# Altium schematic sheet Thermistors.SchDoc: Thermistors
size Letter; DocumentNumber: 7; SheetNumber: 7; SheetTotal: 11
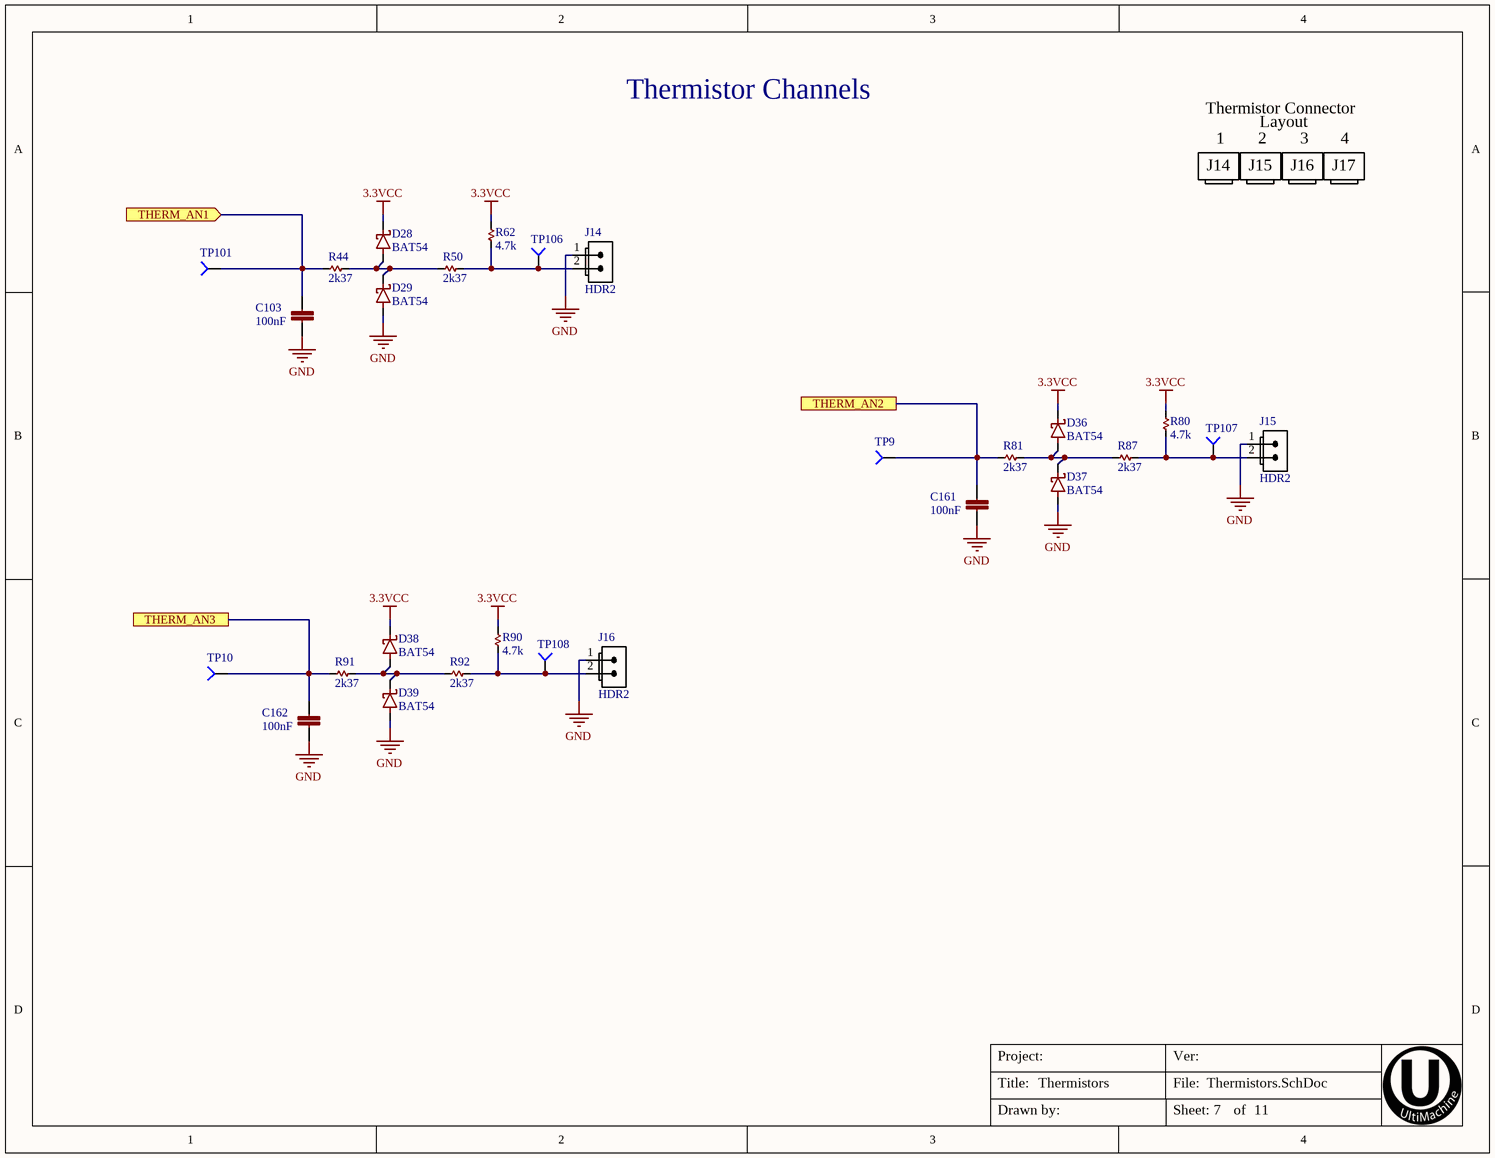
[diagram p0: Thermistors.SchDoc]

## Parts
C103  100nF  [C0402]
C161  100nF  [C0402]
C162  100nF  [C0402]
D28  BAT54  [SOD523_IPC]
D29  BAT54  [SOD523_IPC]
D36  BAT54  [SOD523_IPC]
D37  BAT54  [SOD523_IPC]
D38  BAT54  [SOD523_IPC]
D39  BAT54  [SOD523_IPC]
J14  value HDR2  [70543-01 PIN-IN-PASTE]  (hidden comment: CONN 2PIN VERT 0.1" SHRD LOCKING PIP)
J15  value HDR2  [70543-01 PIN-IN-PASTE]  (hidden comment: CONN 2PIN VERT 0.1" SHRD LOCKING PIP)
J16  value HDR2  [70543-01 PIN-IN-PASTE]  (hidden comment: CONN 2PIN VERT 0.1" SHRD LOCKING PIP)
R44  2k37  [R0402]
R50  2k37  [R0402]
R62  4.7k  [R0402]
R80  4.7k  [R0402]
R81  2k37  [R0402]
R87  2k37  [R0402]
R90  4.7k  [R0402]
R91  2k37  [R0402]
R92  2k37  [R0402]
TP9  TP4  [TP-2]  (value not drawn)  (no BOM)
TP10  TP4  [TP-2]  (value not drawn)  (no BOM)
TP101  TP4  [TP-2]  (value not drawn)  (no BOM)
TP106  TP4  [TP-2]  (value not drawn)  (no BOM)
TP107  TP4  [TP-2]  (value not drawn)  (no BOM)
TP108  TP4  [TP-2]  (value not drawn)  (no BOM)

## Ports
THERM_AN1 (in), THERM_AN2, THERM_AN3

## Nets
3.3VCC: D28.K D36.K D38.K R62.2 R80.2 R90.2
GND: C103.2 C161.2 C162.2 D29.A D37.A D39.A J14.1(S) J15.1(S) J16.1(S)
THERM_AN1: C103.1 R44.1 TP101.1 ; port THERM_AN1
THERM_AN2: C161.1 R81.1 TP9.1 ; port THERM_AN2
THERM_AN3: C162.1 R91.1 TP10.1 ; port THERM_AN3
NetD28_A: D28.A D29.K R44.2 R50.1
NetD36_A: D36.A D37.K R81.2 R87.1
NetD38_A: D38.A D39.K R91.2 R92.1
NetJ14_2: J14.2(S) R50.2 R62.1 TP106.1
NetJ15_2: J15.2(S) R80.1 R87.2 TP107.1
NetJ16_2: J16.2(S) R90.1 R92.2 TP108.1

## Notes on the sheet
- Thermistor Channels
- Thermistor Connector
- 1
- 2
- Layout
- 3
- 4
- J14
- J15
- J16
- J17
- Title:
- Project:
- File:
- Ver:
- Drawn by:
- Sheet:
- of

## Library data of the parts
C103 C161 C162 = GRM155R71C104KA88D: CAP CER 0402 100nF 16V 10% X7R; MANUFACTURER: Murata; PART DESCRIPTION: 0.10µF ±10% 16V Ceramic Capacitor X7R 0402 (1005 Metric); EE_SPEC: 100nF 16V X7R 0402; VALUE: 100nF; MANUFACTURER #: GRM155R71C104KA88D; DISTRIBUTOR #: 490-3261-2-ND; DISTRIBUTOR: Digi-Key Electronics; PART: GRM155R71C104KA88D; TOLERANCE: 10%
D28 D29 D36-D39 = BAT54WX: DIODE SCHOTTKY 30V 200MA SOD523; MANUFACTURER: Diodes Incorporated; MANUFACTURER #: BAT54WX-TP; PART DESCRIPTION: Diode Schottky 30V 200mA (DC) Surface Mount SOD-523; TOLERANCE: -NA-; VALUE: BAT54; DISTRIBUTOR #: BAT54WX-TPTR-ND; DISTRIBUTOR: Digi-Key Electronics; PART: BAT54WX-TP; EE_SPEC: 30V 200mA
J14-J16 = CONN 2PIN VERT 0.1" SHRD LOCKING PIP: Connector 2pos - Pin in Paste; MANUFACTURER: Molex; MANUFACTURER #: 0705430001; PART DESCRIPTION: 2 Positions Header, Shrouded Connector 0.100" (2.54mm) Through Hole Gold; TOLERANCE: -NA-; DISTRIBUTOR #: WM4800-ND; DISTRIBUTOR: Digikey; PART: 0705430001; EE_SPEC: -NA-
R44 R50 R81 R87 R91 R92 = RC0402FR-072K37L: RES SMD 2.37K OHM 1% 1/16W 0402; MANUFACTURER: Yageo; PART DESCRIPTION: 2.37k Ohm ±1% 0.063W, 1/16W Chip Resistor 0402 (1005 Metric) Moisture Resistant Thick Film; VALUE: 2k37; MANUFACTURER #: RC0402FR-072K37L; DISTRIBUTOR #: 311-2.37KLRTR-ND; DISTRIBUTOR: Digi-Key Electronics; PART: RC0402FR-072K37L; TOLERANCE: 1%; EE_SPEC: 1/16W
R62 R80 R90 = RC0402FR-074K7L: RES SMD 4.7K OHM 1% 1/16W 0402; MANUFACTURER: YAGEO; PART DESCRIPTION: 4.7k Ohm ±1% 0.063W, 1/16W Chip Resistor 0402 (1005 Metric) Moisture Resistant Thick Film; VALUE: 4.7k; MANUFACTURER #: RC0402FR-074K7L; DISTRIBUTOR #: 311-4.7KLRTR-ND; DISTRIBUTOR: Digi-Key Electronics; PART: RC0402FR-074K7L; TOLERANCE: 1%; EE_SPEC: 1/16W
TP9 TP10 TP101 TP106-TP108 = Socket: MANUFACTURER #: NOTAPART-Testpoint; PART: NOTAPART-Testpoint